# Altium schematic sheet LED control circuit.SchDoc: LED control Circuit
size A4; Revision: 1.0.0; SheetNumber: 2; SheetTotal: 3
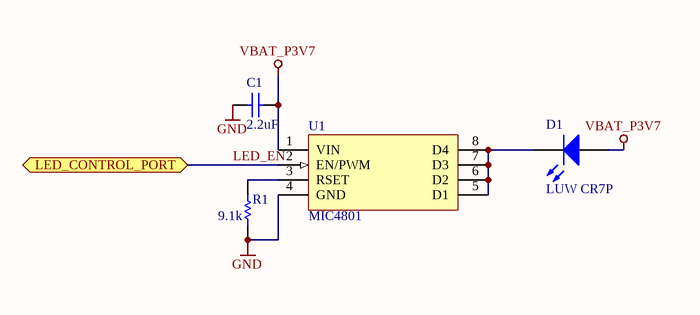
[diagram p0: LED control circuit.SchDoc]

## Parts
C1  value 2.2uF  [1608[0603]]  (hidden comment: C0603C225K8PACTU)
D1  LUW CR7P  [LUW CR7P]
R1  value 9.1k  [3-0603]  (hidden comment: ERJ-3GEYJ912V)
U1  MIC4801  [SOIC-8N]

## Ports
LED_CONTROL_PORT

## Nets
GND: C1.1 D1.3(PAD) R1.1 U1.4(GND)
VBAT_P3V7: C1.2 D1.1(A) U1.1(VIN)
LED_EN: U1.2(EN/PWM) ; port LED_CONTROL_PORT
NetD1_2: D1.2(K) U1.5(D1) U1.6(D2) U1.7(D3) U1.8(D4)
NetR1_2: R1.2 U1.3(RSET)

## Notes on the sheet
- Title
- Size:
- Date:
- A4
- Number:
- Time:
- Revision:
- Sheet
- of
- File:

## Library data of the parts
C1 = C0603: Ceramic Chip Capacitor - Standard; Note: Footprint corresponds to dimensions for bulk cassette packaging. This case size has tightened tolerances.; Published: 17-Jul-2002; LatestRevisionDate: 19-Mar-2004; LatestRevisionNote: Silkscreen size reduced.; DatasheetDocument: Mar-2001; PackageDocument: Mar-2001; PackageReference: 0603; Publisher: Altium Limited; Code_JEITA: 0603; Code_IPC: 1608 [0603]; ComponentLink1Description: Manufacturer Link; ComponentLink1URL: http://www.kemet.com/; ComponentLink2Description: Datasheet; ComponentLink2URL: http://www.kemet.com/kemet/web/homepage/kechome.nsf/vapubfilesname/F3102TA.pdf/$file/F3102TA.pdf
D1 = LUW CR7P: High birghtness white LED, SMD, 150lm, 80 degree
R1 = ERJ3EK: Precision Thick Film Chip Resistor, 10 Ohm to 1M Ohm Range, 1% and 0.5% Tolerance, 0603 Size, 0.063 W; Published: 17-Dec-2003; LatestRevisionDate: 19-Mar-2004; LatestRevisionNote: Silkscreen size reduced.; PackageDocument: Mar-2003; PackageReference: 3-0603; Publisher: Altium Limited; Code_IPC: 1608 [0603]; ComponentLink1Description: Manufacturer Link; ComponentLink1URL: http://www.panasonic.com/industrial/components/resistive_products.htm; ComponentLink2Description: Datasheet; ComponentLink2URL: http://www.panasonic.com/industrial/components/pdf/AOA0000CE2.pdf
U1 = MIC4801: WLED driver, 600mA, linear LDO, constant current